# EAGLE design large-vfd-clock (EAGLE 7.5.0)
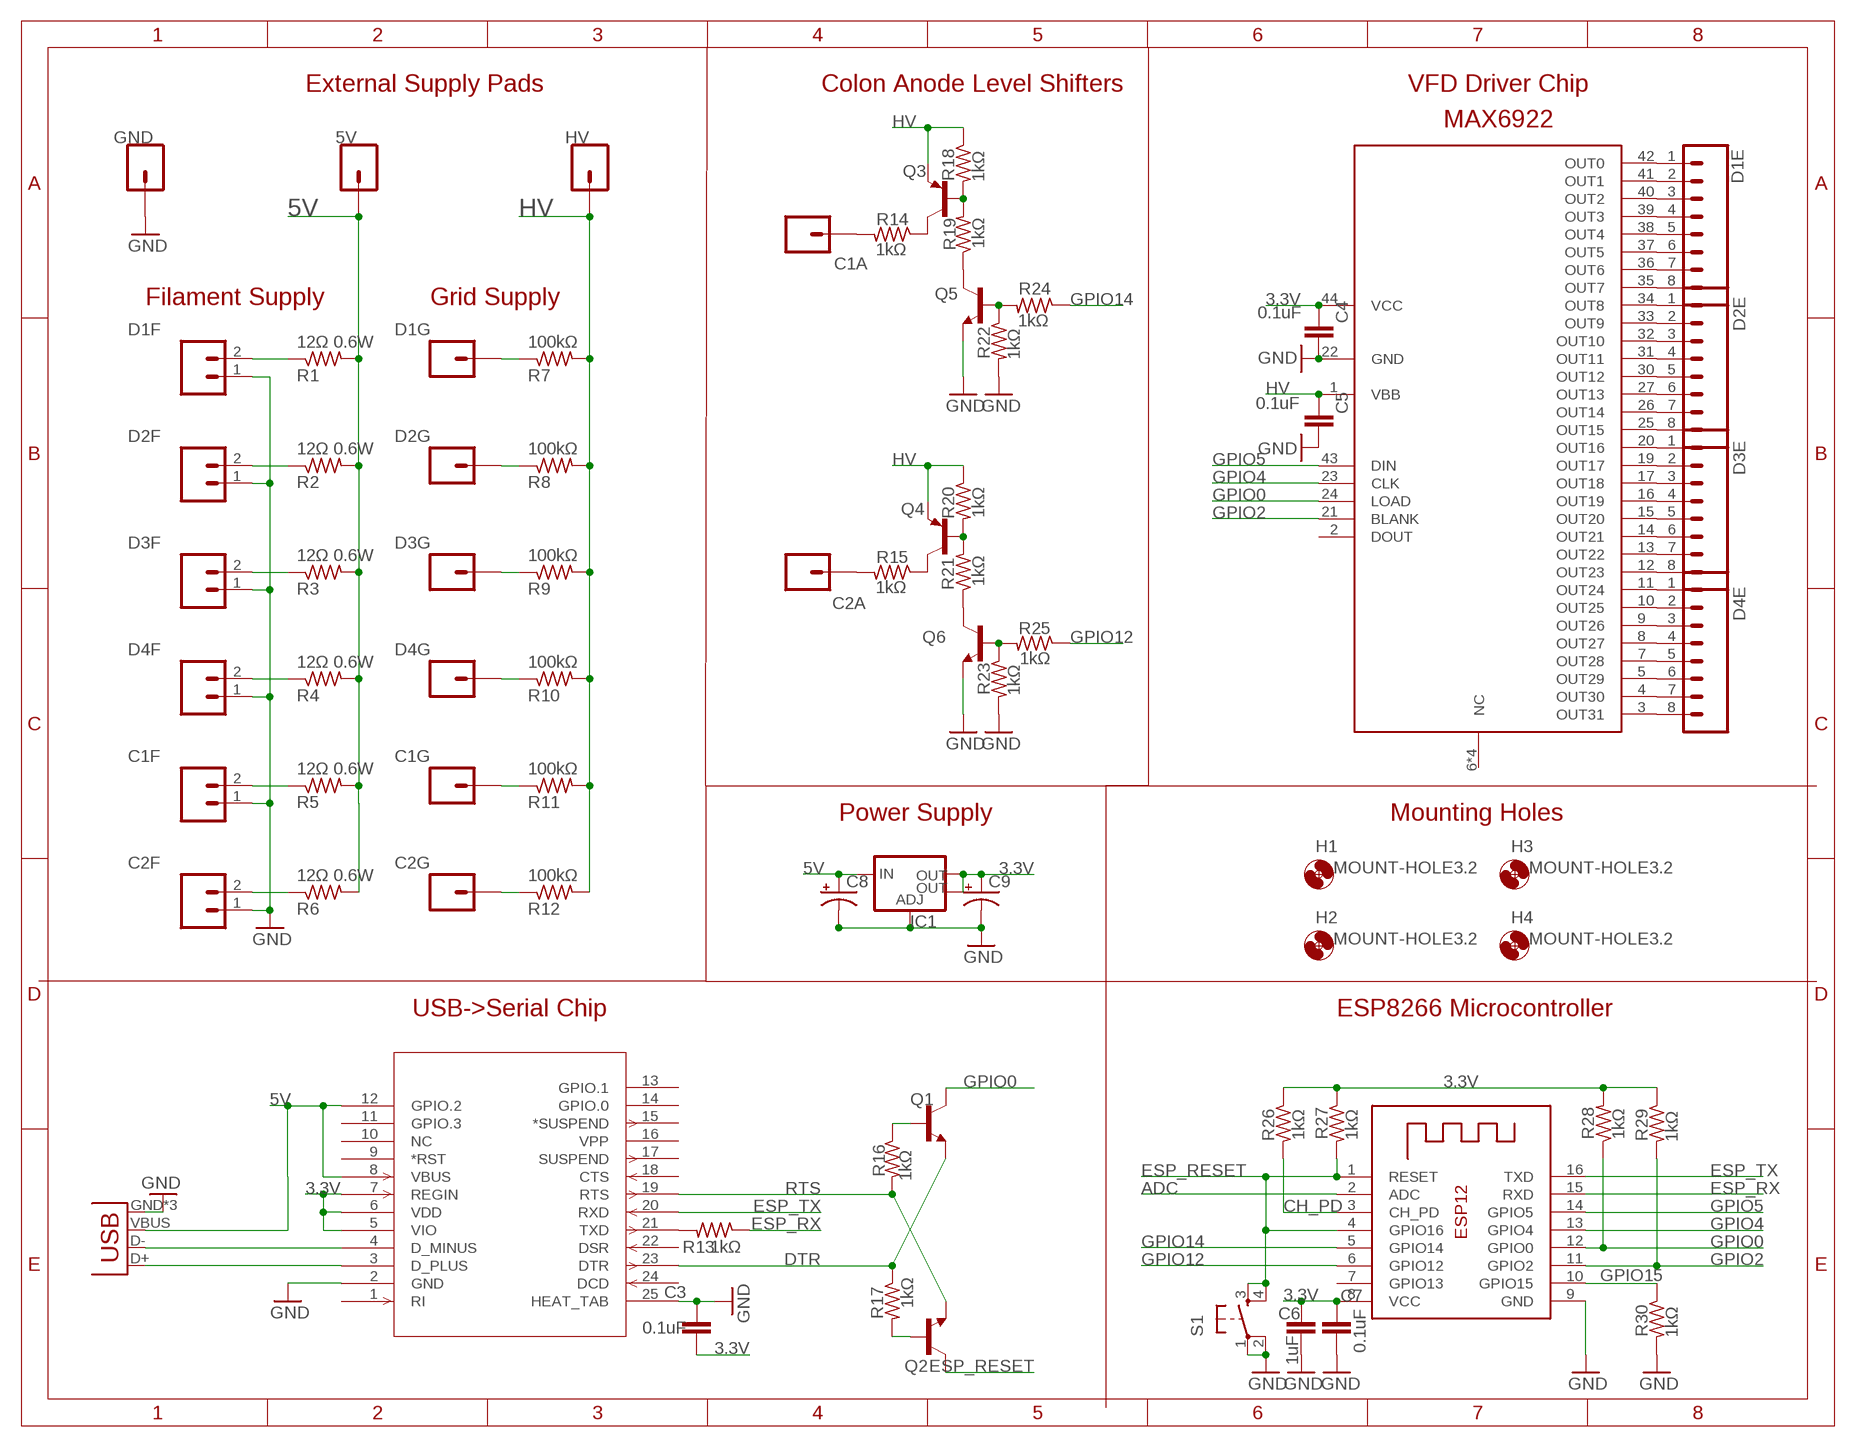
[diagram p0: schematic, sheet 1]

## Parts
5V  M01PTH_LONGPAD  [1X01_LONGPAD]
C1A  M01PTH_LONGPAD  [1X01_LONGPAD]
C1F  M02LOCK_LONGPADS  [1X02_LOCK_LONGPADS]
C1G  M01PTH_LONGPAD  [1X01_LONGPAD]
C2A  M01PTH_LONGPAD  [1X01_LONGPAD]
C2F  M02LOCK_LONGPADS  [1X02_LOCK_LONGPADS]
C2G  M01PTH_LONGPAD  [1X01_LONGPAD]
C3  0.1uF  C-EU025-024X044  [C025-024X044]
C4  0.1uF  C-EU025-024X044  [C025-024X044]
C5  0.1uF  C-EU025-024X044  [C025-024X044]
C6  1uF  C-EU025-024X044  [C025-024X044]
C7  0.1uF  C-EU025-024X044  [C025-024X044]
C8  CPOL-USE2,5-6E  [E2,5-6E]
C9  CPOL-USE2,5-6E  [E2,5-6E]
D1E  M08LOCK_LONGPADS  [1X08_LOCK_LONGPADS]
D1F  M02LOCK_LONGPADS  [1X02_LOCK_LONGPADS]
D1G  M01PTH_LONGPAD  [1X01_LONGPAD]
D2E  M08LOCK_LONGPADS  [1X08_LOCK_LONGPADS]
D2F  M02LOCK_LONGPADS  [1X02_LOCK_LONGPADS]
D2G  M01PTH_LONGPAD  [1X01_LONGPAD]
D3E  M08LOCK_LONGPADS  [1X08_LOCK_LONGPADS]
D3F  M02LOCK_LONGPADS  [1X02_LOCK_LONGPADS]
D3G  M01PTH_LONGPAD  [1X01_LONGPAD]
D4E  M08LOCK_LONGPADS  [1X08_LOCK_LONGPADS]
D4F  M02LOCK_LONGPADS  [1X02_LOCK_LONGPADS]
D4G  M01PTH_LONGPAD  [1X01_LONGPAD]
GND  M01PTH_LONGPAD  [1X01_LONGPAD]
H1  MOUNT-HOLE3.2  [3,2]
H2  MOUNT-HOLE3.2  [3,2]
H3  MOUNT-HOLE3.2  [3,2]
H4  MOUNT-HOLE3.2  [3,2]
HV  M01PTH_LONGPAD  [1X01_LONGPAD]
IC1  V_REG_LM1117SOT223  [SOT223]
JP8  SPARKFUN-CONNECTORS_USB-MICROB  [SPARKFUN-CONNECTORS_USB-MICROB]
Q1  MMBT2222A  TRANSISTOR_NPNTO92  [TO-92]
Q2  MMBT2222A  TRANSISTOR_NPNTO92  [TO-92]
Q3  MMBT3906  2N3906  [TO92]
Q4  MMBT3906  2N3906  [TO92]
Q5  MMBT2222A  TRANSISTOR_NPNTO92  [TO-92]
Q6  MMBT2222A  TRANSISTOR_NPNTO92  [TO-92]
R1  12Ω 0.6W  R-US_0207/7  [0207/7]
R2  12Ω 0.6W  R-US_0207/7  [0207/7]
R3  12Ω 0.6W  R-US_0207/7  [0207/7]
R4  12Ω 0.6W  R-US_0207/7  [0207/7]
R5  12Ω 0.6W  R-US_0207/7  [0207/7]
R6  12Ω 0.6W  R-US_0207/7  [0207/7]
R7  100kΩ  R-US_0207/7  [0207/7]
R8  100kΩ  R-US_0207/7  [0207/7]
R9  100kΩ  R-US_0207/7  [0207/7]
R10  100kΩ  R-US_0207/7  [0207/7]
R11  100kΩ  R-US_0207/7  [0207/7]
R12  100kΩ  R-US_0207/7  [0207/7]
R13  1kΩ  R-US_0207/7  [0207/7]
R14  1kΩ  R-US_0207/7  [0207/7]
R15  1kΩ  R-US_0207/7  [0207/7]
R16  1kΩ  R-US_0207/7  [0207/7]
R17  1kΩ  R-US_0207/7  [0207/7]
R18  1kΩ  R-US_0207/7  [0207/7]
R19  1kΩ  R-US_0207/7  [0207/7]
R20  1kΩ  R-US_0207/7  [0207/7]
R21  1kΩ  R-US_0207/7  [0207/7]
R22  1kΩ  R-US_0207/7  [0207/7]
R23  1kΩ  R-US_0207/7  [0207/7]
R24  1kΩ  R-US_0207/7  [0207/7]
R25  1kΩ  R-US_0207/7  [0207/7]
R26  1kΩ  R-US_0207/7  [0207/7]
R27  1kΩ  R-US_0207/7  [0207/7]
R28  1kΩ  R-US_0207/7  [0207/7]
R29  1kΩ  R-US_0207/7  [0207/7]
R30  1kΩ  R-US_0207/7  [0207/7]
S1  TAC_SWITCHPTH  [TACTILE-PTH]
U1  CP2104-GM  [QFN24_4X4]
U2  MAX6922  [PLCC44]
X1  ESP-12  [ESP-12]

## Nets
3.3V [power]: C3.2 C4.1 C6.1 C7.1 C9.+ IC1.2(OUT) IC1.4(OUT) R26.1 R27.1 R28.2 R29.1 U1.5(VIO) U1.6(VDD) U1.7(REGIN) U2.44(VCC) X1.8(VCC)
5V [power]: 5V.1 C8.+ IC1.3(IN) JP8.VBUS R1.2 R2.2 R3.2 R4.2 R5.2 R6.2 U1.8(VBUS) U1.12(GPIO.2)
ADC: X1.2(ADC)
CH_PD: R26.2 X1.3(CH_PD)
D_N1 [usb lines]: JP8.D- U1.4(D_MINUS)
D_P1 [usb lines]: JP8.D+ U1.3(D_PLUS)
DTR: Q1.1(E) R17.1 U1.23(DTR)
ESP_RESET: Q2.3(C) R27.2 S1.3 S1.4 X1.1(RESET) X1.4(GPIO16)
ESP_RX: R13.1 X1.15(RXD)
ESP_TX: U1.20(RXD) X1.16(TXD)
GND [power]: C1F.1 C2F.1 C3.1 C4.2 C5.2 C6.2 C7.2 C8.- C9.- D1F.1 D2F.1 D3F.1 D4F.1 GND.1 IC1.1(ADJ) JP8.GND JP8.MT1(GND) JP8.MT2(GND) Q5.1(E) Q6.1(E) R22.2 R23.2 R30.2 S1.1 S1.2 U1.2(GND) U1.25(HEAT_TAB) U2.22(GND) X1.9(GND)
GPIO0: Q1.3(C) R28.1 U2.24(LOAD) X1.12(GPIO0)
GPIO2: R29.2 U2.21(BLANK) X1.11(GPIO2)
GPIO4: U2.23(CLK) X1.13(GPIO4)
GPIO5: U2.43(DIN) X1.14(GPIO5)
GPIO12: R25.1 X1.6(GPIO12)
GPIO14: R24.1 X1.5(GPIO14)
GPIO15: R30.1 X1.10(GPIO15)
HV [power]: C5.1 HV.1 Q3.3(E) Q4.3(E) R7.2 R8.2 R9.2 R10.2 R11.2 R12.2 R18.1 R20.1 U2.1(VBB)
N$2: R13.2 U1.21(TXD)
N$5: D1E.1 U2.42(OUT0)
N$6: Q1.2(B) R16.1
N$7: Q2.2(B) R17.2
N$10: D1E.2 U2.41(OUT1)
N$12: D1E.3 U2.40(OUT2)
N$13: D1E.4 U2.39(OUT3)
N$14: D1E.5 U2.38(OUT4)
N$15: D1E.6 U2.37(OUT5)
N$16: D1E.7 U2.36(OUT6)
N$17: D1E.8 U2.35(OUT7)
N$18: D2E.1 U2.34(OUT8)
N$19: D2E.2 U2.33(OUT9)
N$20: D2E.3 U2.32(OUT10)
N$21: D2E.4 U2.31(OUT11)
N$22: D2E.5 U2.30(OUT12)
N$23: D2E.6 U2.27(OUT13)
N$24: D2E.7 U2.26(OUT14)
N$25: D2E.8 U2.25(OUT15)
N$26: D3E.1 U2.20(OUT16)
N$27: D3E.2 U2.19(OUT17)
N$28: D3E.3 U2.17(OUT18)
N$29: D3E.4 U2.16(OUT19)
N$30: D3E.5 U2.15(OUT20)
N$31: D3E.6 U2.14(OUT21)
N$32: D3E.7 U2.13(OUT22)
N$33: D3E.8 U2.12(OUT23)
N$34: D4E.1 U2.11(OUT24)
N$35: D4E.2 U2.10(OUT25)
N$36: D4E.3 U2.9(OUT26)
N$37: D4E.4 U2.8(OUT27)
N$38: D4E.5 U2.7(OUT28)
N$39: D4E.6 U2.5(OUT29)
N$40: D4E.7 U2.4(OUT30)
N$41: D4E.8 U2.3(OUT31)
N$42: Q5.2(B) R22.1 R24.2
N$43: Q6.2(B) R23.1 R25.2
N$44: D4G.1 R10.1
N$45: D3G.1 R9.1
N$46: D2G.1 R8.1
N$47: D1G.1 R7.1
N$48: C2G.1 R12.1
N$49: C1G.1 R11.1
N$50: C1F.2 R5.1
N$51: C2F.2 R6.1
N$52: Q4.1(C) R15.1
N$53: Q3.1(C) R14.1
N$54: C1A.1 R14.2
N$55: C2A.1 R15.2
N$58: D1F.2 R1.1
N$59: D2F.2 R2.1
N$60: D3F.2 R3.1
N$61: D4F.2 R4.1
N$63: Q5.3(C) R19.1
N$64: Q3.2(B) R18.2 R19.2
N$65: Q6.3(C) R21.1
N$66: Q4.2(B) R20.2 R21.2
RTS: Q2.1(E) R16.2 U1.19(RTS)
Unconnected: U1.1(RI) U1.9(*RST) U1.10(NC) U1.11(GPIO.3) U1.13(GPIO.1) U1.14(GPIO.0) U1.15(*SUSPEND) U1.16(VPP) U1.17(SUSPEND) U1.18(CTS) U1.22(DSR) U1.24(DCD) U2.2(DOUT) U2.6(NC) U2.18(NC) U2.28(NC) U2.29(NC) X1.7(GPIO13)

## Notes on the sheet
- External Supply Pads | Colon Anode Level Shifters | VFD Driver Chip
- MAX6922
- Filament Supply | Grid Supply
- Power Supply | Mounting Holes
- USB->Serial Chip | ESP8266 Microcontroller

## Library data of the parts
5V C1A C1G C2A C2G D1G D2G D3G D4G GND HV = SparkFun-Connectors:M01: Header 1 Standard 1-pin 0.1" header. Use with straight break away headers (SKU : PRT-00116), right angle break away headers (PRT-00553), swiss pins (PRT-00743), machine pins (PRT-00117), and female headers (PRT-00115). SMTSO-256-ET is a "flush mount" nut for a 4-40 screw. The older package used to be too tight, and did not allow it to sit properly thru the drill hit. The latest (0.165DIA) fits nice and snug.
C1F C2F D1F D2F D3F D4F = SparkFun-Connectors:M02: Standard 2-pin 0.1" header. Use with - straight break away headers ( PRT-00116) - right angle break away headers (PRT-00553) - swiss pins (PRT-00743) - machine pins (PRT-00117) - female headers (PRT-00115) Molex polarized connector foot print use with: PRT-08233 with associated crimp pins and housings. 2.54_SCREWTERM for use with PRT-10571. 3.5mm Screw Terminal footprints for PRT-08084 5mm Screw Terminal footprints for use with PRT-08432
C3-C7 = rcl:C-EU: CAPACITOR, European symbol
C8 C9 = rcl:CPOL-US: POLARIZED CAPACITOR, American symbol
D1E D2E D3E D4E = SparkFun-Connectors:M08: Header 8 Standard 8-pin 0.1" header. Use with straight break away headers (SKU : PRT-00116), right angle break away headers (PRT-00553), swiss pins (PRT-00743), machine pins (PRT-00117), and female headers (PRT-00115).
H1-H4 = holes:MOUNT-HOLE: MOUNTING HOLE with drill center marker
IC1 = SparkFun-PowerIC:V_REG_LM1117: Voltage Regulator LM1117 Standard adjustable voltage regulator but in SMD form. Spark Fun Electronics SKU : COM-00595; PROD_ID: VREG-08170
JP8 = passKeyDev2:SPARKFUN-CONNECTORS_USB: USB Connectors USB-B-PTH is fully proven SKU : PRT-00139/CONN-08278 USB-miniB is fully proven SKU : PRT-00587 USB-A-PCB is untested. USB-A-H is throughly reviewed, but untested. Spark Fun Electronics SKU : PRT-00437 USB-B-SMT is throughly reviewed, but untested. Needs silkscreen touching up. USB-A-S has not been used/tested USB-MB-H has not been used/tested USB-MICROB has been used. CONN-09505; PROD_ID: CONN-09505
Q1 Q2 Q5 Q6 = SparkFun-DiscreteSemi:TRANSISTOR_NPN: Generic NPN BJT MMBT2222A - TRANS-08049 (SOT-23, 1A 40V) MPSA42 - TRANS-09116 (SOT-23, 500mA 300V) MMBT5088LT1G - TRANS-11160 (SOT-23, 50 mA 30V) BC547 - COM-08928 <http://www.sparkfun.com/products/8928> (TO-92 45V 100mA) (1.Collector 2.Base 3.Emitter) 2N3904 - COM-00521 <http://www.sparkfun.com/products/521> (TO-92 40V 200mA) (1.Emitter 2.Base 3.Collector) P2N2222A - COM-12852 <http://www.sparkfun.com/products/12852> (TO-92 40V 600mA) (1.Collector 2.Base 3.Emitter)
Q3 Q4 = transistor-pnp:2N3906: PNP Transistor
R1-R30 = resistor:R-US_: RESISTOR, American symbol
S1 = SparkFun-Electromechanical:TAC_SWITCH: Momentary Switch Button commonly used for reset or general input. Spark Fun Electronics SKU : COM-00097 SMT- SWCH-08247
U1 = cp2104:CP2104-GM
U2 = sonik:MAX6922
X1 = adafruit:ESP-12

## Net classes
2 power: width 0.254 mm

## Board
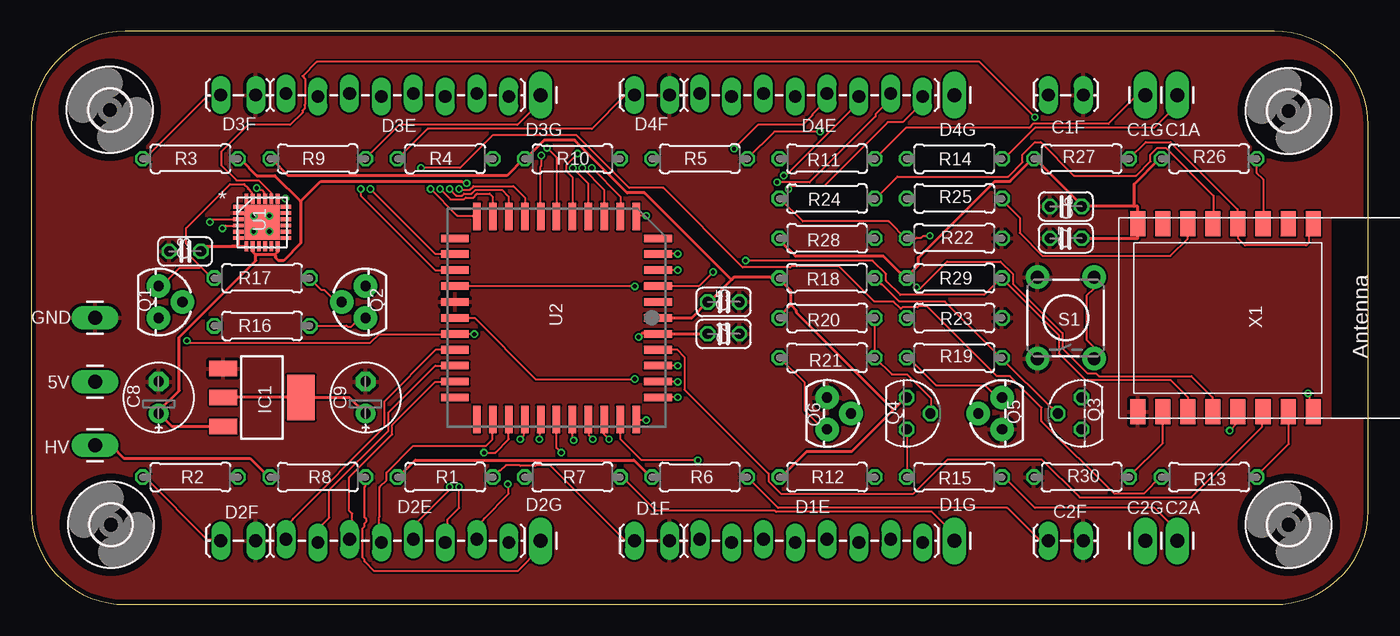
[diagram p1: board, top side]
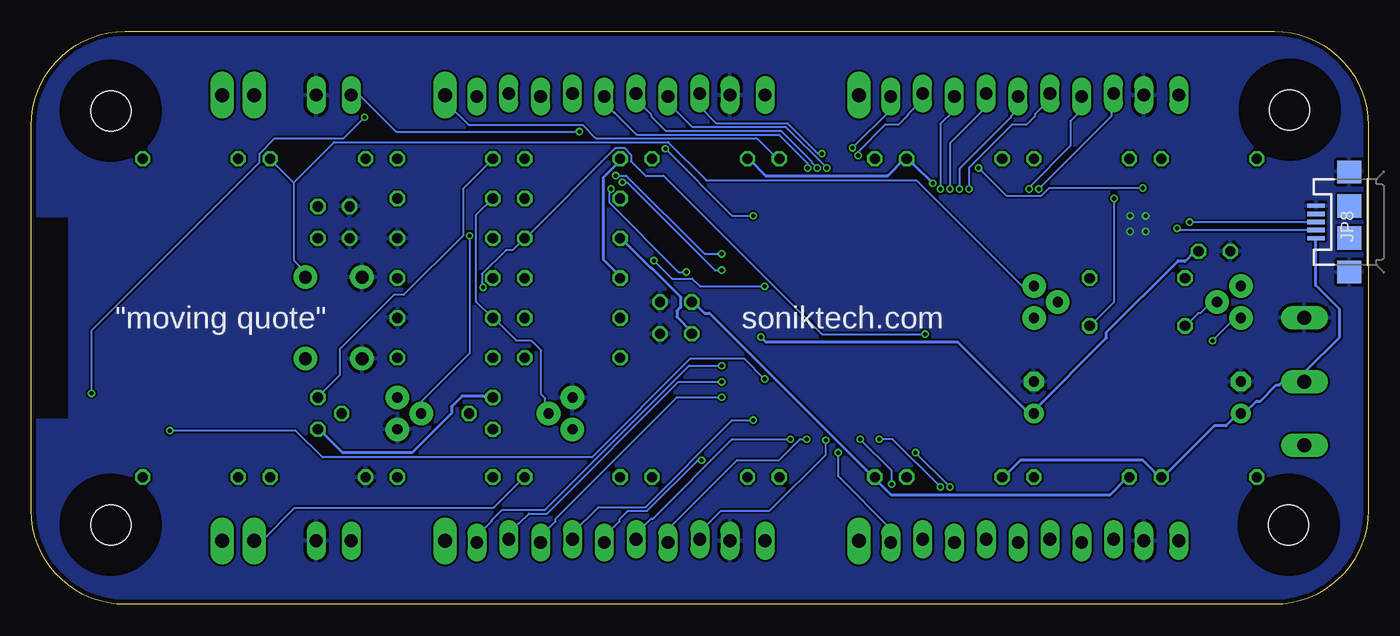
[diagram p2: board, bottom side, seen from below]

Size 106.68 x 45.72 mm. Coordinates in mm from the lower left corner, seen from the top.
Outline: 106.68,7.5 106.68,38.22 arc90 99.18,45.72 7.5,45.72 arc90 0,38.22 0,7.5 arc90 7.5,0 99.18,0 arc90 106.68,7.5
Copper layers (1*16): Top 0.0356mm / dielectric 1.5011mm / Bottom 0.0356mm
Design rules "OSHparkDruTented": minimum track width 6mil, minimum drill 13mil, track to track 6mil, track to pad 6mil, pad to pad 6mil, via to via 6mil, smd to smd 5mil, copper to edge 15mil, drill to drill 6mil, minimum pad ring 5mil, minimum via ring 5mil, stop-mask expansion 3mil, vias tented up to drill 14mil, thermal gap 10mil

### Footprints (pad centres in the part's own frame; a part is rotated, then mirrored left to right if it is on the bottom)
1X01_LONGPAD = drill 1.118 pad 1.88 long: 1 0,0
1X02_LOCK_LONGPADS = drill 1.016 long: 1 -0.127,0; 2 2.667,0
C025-024X044 = drill 0.813 octagon: 1 -1.27,0; 2 1.27,0
E2,5-6E = drill 0.813 pad 1.575: + -1.27,0 | drill 0.813 pad 1.575 octagon: - 1.27,0
1X08_LOCK_LONGPADS = drill 1.016 long: 1 0,0.127; 2 2.54,-0.127; 3 5.08,0.127; 4 7.62,-0.127; 5 10.16,0.127; 6 12.7,-0.127; 7 15.24,0.127; 8 17.78,-0.127
3,2 = hole 3.2: 0,0
SOT223 = smd 1.219 x 2.235: 1 -2.311,-3.099; 2 0,-3.099; 3 2.311,-3.099 | smd 3.6 x 2.2: 4 0,3.099
SPARKFUN-CONNECTORS_USB-MICROB = smd 0.35 x 1.4: D+ 0,2.65; D- -0.65,2.65; GND 1.3,2.65; ID 0.65,2.65; VBUS -1.3,2.65 | smd 1.8 x 1.9: MT1 -4,0; MT2 4,0 | smd 1.9 x 1.9: P$1 -1.27,0; P$2 1.27,0
TO-92 = drill 0.813 pad 1.88: 1 -1.27,0; 2 0,1.905; 3 1.27,0
TO92 = drill 0.813 octagon: 1 1.27,0; 2 0,1.905; 3 -1.27,0
0207/7 = drill 0.813 octagon: 1 -3.81,0; 2 3.81,0
TACTILE-PTH = drill 1.016 pad 1.88: 1 -3.251,2.261; 2 3.251,2.261; 3 -3.251,-2.261; 4 3.251,-2.261
QFN24_4X4 = smd 0.813 x 0.305: 1 -1.892,1.25; 2 -1.892,0.75; 3 -1.892,0.25; 4 -1.892,-0.25; 5 -1.892,-0.75; 6 -1.892,-1.25; 13 1.892,-1.25; 14 1.892,-0.75; 15 1.892,-0.25; 16 1.892,0.25; 17 1.892,0.75; 18 1.892,1.25 | smd 0.305 x 0.813: 7 -1.25,-1.892; 8 -0.75,-1.892; 9 -0.25,-1.892; 10 0.25,-1.892; 11 0.75,-1.892; 12 1.25,-1.892; 19 1.25,1.892; 20 0.75,1.892; 21 0.25,1.892; 22 -0.25,1.892; 23 -0.75,1.892; 24 -1.25,1.892 | smd 2.794 x 2.794: 25 0,0
PLCC44 = smd 0.6 x 2.2: 1 0,8.1; 2 -1.27,8.1; 3 -2.54,8.1; 4 -3.81,8.1; 5 -5.08,8.1; 6 -6.35,8.1; 18 -6.35,-8.1; 19 -5.08,-8.1; 20 -3.81,-8.1; 21 -2.54,-8.1; 22 -1.27,-8.1; 23 0,-8.1; 24 1.27,-8.1; 25 2.54,-8.1; 26 3.81,-8.1; 27 5.08,-8.1; 28 6.35,-8.1; 40 6.35,8.1; 41 5.08,8.1; 42 3.81,8.1; 43 2.54,8.1; 44 1.27,8.1 | smd 2.2 x 0.6: 7 -8.1,6.35; 8 -8.1,5.08; 9 -8.1,3.81; 10 -8.1,2.54; 11 -8.1,1.27; 12 -8.1,0; 13 -8.1,-1.27; 14 -8.1,-2.54; 15 -8.1,-3.81; 16 -8.1,-5.08; 17 -8.1,-6.35; 29 8.1,-6.35; 30 8.1,-5.08; 31 8.1,-3.81; 32 8.1,-2.54; 33 8.1,-1.27; 34 8.1,0; 35 8.1,1.27; 36 8.1,2.54; 37 8.1,3.81; 38 8.1,5.08; 39 8.1,6.35
ESP-12 = smd 2 x 1.2: 1 -7.5,4.5; 2 -7.5,2.5; 3 -7.5,0.5; 4 -7.5,-1.5; 5 -7.5,-3.5; 6 -7.5,-5.5; 7 -7.5,-7.5; 8 -7.5,-9.5; 9 7.5,-9.5; 10 7.5,-7.5; 11 7.5,-5.5; 12 7.5,-3.5; 13 7.5,-1.5; 14 7.5,0.5; 15 7.5,2.5; 16 7.5,4.5

### Placement (x,y rotation side)
5V  5.08,17.78 270 top
C1A  91.44,40.64 0 top
C1F  83.82,40.64 180 top
C1G  88.9,40.64 0 top
C2A  91.44,5.08 0 top
C2F  83.82,5.08 180 top
C2G  88.9,5.08 0 top
C3  12.27,28.17 0 top
C4  55.24,21.59 0 top
C5  55.24,24.13 0 top
C6  82.55,31.75 180 top
C7  82.55,29.21 180 top
C8  10.16,16.51 90 top
C9  26.67,16.51 90 top
D1E  71.12,5.08 180 top
D1F  50.8,5.08 180 top
D1G  73.66,5.08 0 top
D2E  38.1,5.08 180 top
D2F  17.78,5.08 180 top
D2G  40.64,5.08 0 top
D3E  20.32,40.64 0 top
D3F  17.78,40.64 180 top
D3G  40.64,40.64 180 top
D4E  53.34,40.64 0 top
D4F  50.8,40.64 180 top
D4G  73.66,40.64 180 top
GND  5.08,22.86 270 top
H1  6.27,39.45 270 top
H2  6.35,6.35 270 top
H3  100.33,39.37 270 top
H4  100.33,6.35 270 top
HV  5.08,12.7 270 top
IC1  18.41,16.51 270 top
JP8  1.5,30.51 90 bottom
Q1  10.16,24.13 270 top
Q2  26.67,24.13 90 top
Q3  83.82,15.24 90 top
Q4  69.85,15.24 270 top
Q5  77.47,15.24 90 top
Q6  63.5,15.24 270 top
R1  33.02,10.16 180 top
R2  12.7,10.16 0 top
R3  12.7,35.56 0 top
R4  33.02,35.56 0 top
R5  53.34,35.56 180 top
R6  53.34,10.16 180 top
R7  43.18,10.16 180 top
R8  22.86,10.16 180 top
R9  22.86,35.56 180 top
R10  43.18,35.56 180 top
R11  63.5,35.56 180 top
R12  63.5,10.16 180 top
R13  93.98,10.16 180 top
R14  73.66,35.56 0 top
R15  73.66,10.16 0 top
R16  18.41,22.23 0 top
R17  18.41,26.04 0 top
R18  63.5,26.04 0 top
R19  73.66,19.68 0 top
R20  63.5,22.86 0 top
R21  63.5,19.68 0 top
R22  73.66,29.21 0 top
R23  73.66,22.86 0 top
R24  63.5,32.38 180 top
R25  73.66,32.38 180 top
R26  93.98,35.56 0 top
R27  83.82,35.56 0 top
R28  63.5,29.21 180 top
R29  73.66,26.04 0 top
R30  83.82,10.16 180 top
S1  82.55,22.86 90 top
U1  18.41,30.48 0 top
U2  41.91,22.86 270 top
X1  97.79,22.86 270 top

### Tracks (layer width: path | path; a pad name or v marks a point on that pad's centre or on a via)
3.3V  (via drill 0.33)
  Top 0.254: 88.01,31.75 88.29,31.75 X1.8 88.29,29.21 C7.1 | 88.01,31.75 C6.1 83.82,31.85 80.16,35.51 80.01,35.51 R27.1 79.93,35.43 79.78,35.43 78.11,33.76 76.89,33.76 70.79,27.66 70.79,27.05 69.88,26.14 R29.1 69.8,26.06 69.42,26.44 69.34,26.44 67.97,27.81 60.96,27.81 59.74,29.03 59.74,29.18 R28.2 | C4.1 U2.44 49.91,21.64 48.77,21.64 v48.46,21.34 | C9.+ 25.4,16.51 IC1.4 21.41,16.54 15.32,16.54 IC1.2 | C3.2 13.54,28.59 16,28.59 | 16,28.59 U1.7 | U1.5 U1.6 16.52,28.59 16,28.59 | R26.1 90.14,35.51 89.99,35.51 88.01,33.53 88.01,31.85 88.01,31.75
  Bottom 0.254: C3.2 13.56,28.12 13.87,28.12 14.63,27.36 14.71,27.43 15.16,27.43 20.88,21.72 20.88,21.26 26.67,15.47 C9.+ 26.75,15.54 27.36,15.54 32.77,20.95 48.08,20.95 v48.46,21.34 | C4.1 54.03,21.64 54.03,21.79 55.17,22.94 55.17,23.39 54.86,23.7 54.86,24.54 57.15,26.82 57.23,26.82 59.66,29.26 R28.2
5V  (via drill 0.33)
  Top 0.254: IC1.3 11.2,14.2 C8.+ 10.06,15.32 11.81,17.07 11.81,21.34 17.91,27.43 17.91,27.81 17.91,27.89 | 17.91,27.89 17.68,28.12 17.68,28.57 U1.8 | 19.43,27.89 17.91,27.89 | 19.43,27.89 19.66,28.12 19.66,28.57 U1.12 | 21.49,32.16 21.49,28.8 20.12,27.43 19.74,27.43 19.51,27.66 19.51,27.81 19.43,27.89 | 21.49,32.16 19.43,34.21 17.98,34.21 16.69,35.51 16.54,35.51 R3.2 | R6.2 49.53,10.21 49.38,10.21 48.08,11.51 30.63,11.51 29.26,10.13 R1.2 | v34.75,33.6 34.52,33.6 34.37,33.76 23.09,33.76 21.57,32.23 21.49,32.16
  Bottom 0.254: JP8.VBUS 4.19,29.18 4.19,25.45 2.29,23.55 2.29,21.34 5.03,18.59 5.03,17.83 5V.1 5.18,17.75 6.86,17.75 7.09,17.53 7.32,17.53 8.61,16.23 8.91,16.23 9.83,15.32 10.06,15.32 C8.+ 10.21,15.24 10.36,15.24 11.35,14.25 12.27,14.25 16.31,10.21 16.46,10.21 R2.2 16.61,10.13 17.98,11.51 27.74,11.51 29.03,10.21 29.18,10.21 R1.2 | R5.2 49.53,35.51 49.38,35.51 48.08,34.21 38.33,34.21 37.03,35.51 36.88,35.51 R4.2 36.73,35.51 36.35,35.13 36.27,35.13 v34.75,33.6
CH_PD
  Top 0.152: X1.3 98.3,30.4 98.3,33.91 97.77,34.44 97.77,35.51 R26.2
D_N1  (via drill 0.33)
  Top 0.152: v15.25,30 15.48,30.23 U1.4
  Bottom 0.152: JP8.D- 15.25,29.86 v15.25,30
D_P1  (via drill 0.33)
  Top 0.152: v14.25,30.5 14.48,30.73 U1.3
  Bottom 0.152: JP8.D+ v14.25,30.51 v14.25,30.5
DTR
  Top 0.152: 13.53,26.94 14.4,26.06 14.55,26.06 R17.1 | 13.53,26.94 12.65,27.81 12.65,28.5 12.34,28.8 12.34,30.02 15.85,33.53 16.99,33.53 17.3,33.22 17.3,33.15 17.6,32.84 17.6,32.38 U1.23 | Q1.1 10.21,25.45 10.44,25.45 11.81,26.82 13.41,26.82 13.49,26.9 13.53,26.94
ESP_RESET
  Top 0.152: X1.1 102.26,30.33 101.96,30.02 101.96,28.88 101.73,28.65 96.85,28.65 96.32,29.18 96.32,30.33 X1.4 96.24,30.4 96.24,31.55 90.91,36.88 88.92,36.88 87.63,35.59 R27.2 | S1.3 84.81,19.66 84.81,20.5 84.2,21.11 84.2,24.61 84.81,25.22 84.81,26.06 S1.4
  Bottom 0.152: 85.76,33.64 85.72,33.6 85.72,27.43 84.81,26.52 84.81,26.14 S1.4 | 85.76,33.64 87.63,35.51 R27.2 | Q2.3 26.67,25.38 27.58,25.38 36.04,33.83 52.81,33.83 55.85,36.88 82.53,36.88 85.72,33.68 85.76,33.64
ESP_RX
  Top 0.152: X1.15 100.36,15.32 100.36,12.8 97.77,10.21 R13.1
ESP_TX  (via drill 0.33)
  Top 0.152: v80.09,38.86 75.67,43.28 22.78,43.28 21.64,42.14 21.87,41.91 21.87,39.93 21.79,39.85 21.79,39.55 21.64,39.4 21.64,39.24 20.65,38.25 17.3,38.25 15.16,36.12 15.16,35.05 16.38,33.83 18.14,33.83 19.13,32.84 19.13,32.38 U1.20 | v101.88,16.84 102.03,16.69 102.03,15.62 102.26,15.39 X1.16
  Bottom 0.152: v80.09,38.86 81.76,37.19 87.25,37.19 88.47,35.97 88.47,35.28 101.88,21.87 v101.88,16.84
GND  (via drill 0.33)
  Top 0.254: U1.2 16.61,31.17 17.07,31.17 17.75,30.48 18.36,30.48 U1.25 17.75,30.48 v17.75,31
  other vias: 17.75,29.75 19,29.75 19,31
  pour Bottom: 0,45.72 0,0 106.68,0 106.68,45.72
  pour Top: 0,45.72 0,0 106.68,0 106.68,45.72
GPIO0  (via drill 0.33)
  Top 0.152: v12.42,21.03 12.57,20.88 27.05,20.88 27.74,21.57 33.76,21.57 U2.24 33.83,21.57 v35.36,21.57 | v70.64,25.3 70.71,25.22 70.94,25.22 73.08,27.36 77.34,27.36 78.33,26.36 78.33,25.6 82.3,21.64 82.3,20.42 84.28,18.44 84.96,18.44 85.19,18.21 92.58,18.21 94.26,16.54 94.26,15.39 X1.12
  Bottom 0.152: v12.42,21.03 10.59,22.86 10.21,22.86 Q1.3 | v70.64,25.3 70.64,25.6 70.71,25.68 70.71,26.36 68.81,28.27 68.28,28.27 67.36,29.18 R28.1 67.28,29.18 60.05,36.42 59.36,36.42 58.83,35.89 58.83,35.36 57.68,34.21 56.24,34.21 43.59,21.57 v35.36,21.57
GPIO2  (via drill 0.33)
  Top 0.152: X1.11 92.28,15.39 92.28,16.54 90.91,17.91 84.12,17.91 81.99,20.04 81.99,21.49 77.5,25.98 R29.2 77.42,26.06 76.05,24.69 69.34,24.69 68.2,25.83 68.2,26.36 67.13,27.43 v57,27.43 | v48.16,25.38 33.83,25.38 U2.21
  Bottom 0.152: v48.16,25.38 53.34,25.38 53.95,25.98 55.55,25.98 v57,27.43
GPIO4  (via drill 0.33)
  Top 0.152: v95.63,13.87 96.24,14.48 96.24,15.32 X1.13 | v48.16,17.98 40.23,17.98 35.36,22.86 33.83,22.86 U2.23
  Bottom 0.152: v95.63,13.87 85.57,13.87 83.44,11.73 61.95,11.73 54.1,19.58 49.76,19.58 v48.16,17.98
GPIO5
  Top 0.152: X1.14 98.22,15.32 98.22,14.17 92.58,8.53 83.67,8.53 80.62,11.58 73.15,11.58 70.41,8.84 59.82,8.84 58.83,9.83 58.83,10.44 52.12,17.14 52.12,19.74 51.51,20.34 50.06,20.34 U2.43
GPIO12
  Top 0.152: X1.6 92.28,30.33 92.28,29.18 90.91,27.81 80.7,27.81 78.87,29.64 78.87,30.86 77.5,32.23 77.5,32.38 R25.1
GPIO14
  Top 0.152: X1.5 94.34,30.4 94.34,32.61 90.53,36.42 89.84,36.42 89.31,35.89 89.31,35.36 88.16,34.21 83.21,34.21 80.54,36.88 80.09,36.88 79.1,35.89 79.1,35.28 77.95,34.14 69.11,34.14 67.36,32.38 R24.1
GPIO15
  Top 0.152: X1.10 90.3,15.32 90.3,12.88 87.63,10.21 R30.1
HV
  Top 0.254: U2.1 52.7,22.86 C5.1 54.03,24.08 55.85,25.91 | 68.81,15.54 69.8,16.54 Q4.3 | 68.81,15.54 65.46,12.19 61.87,12.19 59.89,10.21 59.74,10.21 R12.2 | R9.2 19.05,35.51 19.2,35.51 20.5,34.21 37.95,34.21 39.32,35.59 R10.2 39.47,35.59 40.92,37.03 43.36,37.03 47.55,32.84 48.92,32.84 55.78,25.98 55.85,25.91 | R8.2 19.05,10.21 18.9,10.21 17.45,11.66 7.39,11.66 6.4,12.65 5.11,12.65 HV.1 | 60.58,23.85 59.74,23.01 59.74,22.86 R20.1 | 60.58,23.85 60.58,25.07 59.66,25.98 R18.1 59.59,26.06 59.05,26.06 58.98,26.14 56.08,26.14 55.85,25.91 | 68.81,15.54 68.73,15.62 61.04,23.32 61.04,23.47 60.66,23.85 60.58,23.85
  Bottom 0.254: Q3.3 83.82,13.95 83.67,13.95 81.84,12.12 76.28,12.12 73.15,15.24 73.15,15.77 72.31,16.61 70.56,16.61 70.48,16.54 69.88,16.54 Q4.3 | R11.2 59.74,35.51 59.74,35.36 61.04,34.06 61.04,27.51 59.74,26.21 59.74,26.06 R18.1 | C5.1 53.95,24.08 53.8,24.08 52.96,23.24 52.58,23.24 39.55,10.21 39.4,10.21 R7.2 39.4,10.06 38.1,8.76 20.57,8.76 19.2,10.13 19.05,10.13 R8.2
N$2  (via drill 0.33)
  Top 0.152: v17.98,33.22 18.14,33.07 18.36,33.07 18.59,32.84 18.59,32.38 U1.21 | v31.09,34.82 34.21,34.82 36.8,37.41 43.51,37.41 47.7,33.22 50.44,33.22 56.77,26.9 60.58,26.9 60.66,26.98 64.47,26.98 67.28,24.16 68.81,24.16 69.34,23.62 69.42,23.62 69.49,23.7 70.71,23.7 70.79,23.77 71.48,23.77 77.04,18.21 78.11,18.21 80.62,15.7 80.62,14.63 86.41,8.84 88.77,8.84 90.14,10.21 R13.2
  Bottom 0.152: v17.98,33.22 25.45,33.22 26.06,32.61 28.88,32.61 v31.09,34.82
N$5  (via drill 0.33)
  Top 0.152: v51.59,19.05 50.06,19.05 U2.42
  Bottom 0.152: v51.59,19.05 54.18,19.05 65.68,7.54 69.11,7.54 69.95,6.71 69.95,6.63 71.09,5.49 71.09,4.95 D1E.1
N$6
  Bottom 0.152: R16.1 14.55,22.25 13.56,23.24 13.41,23.24 12.57,24.08 12.12,24.08 Q1.2
N$7
  Top 0.152: R17.2 22.25,25.98 23.16,25.07 23.39,25.07 24.31,24.16 24.77,24.16 Q2.2
N$10  (via drill 0.33)
  Top 0.152: v51.59,17.75 50.06,17.75 U2.41
  Bottom 0.152: v51.59,17.75 55.02,17.75 65.53,7.24 66.98,7.24 67.74,6.48 67.82,6.48 68.58,5.71 68.58,5.26 D1E.2
N$12  (via drill 0.33)
  Top 0.152: v51.59,16.54 50.06,16.54 U2.40
  Bottom 0.152: v51.59,16.54 55.17,16.54 64.85,6.86 64.85,6.63 65.99,5.49 65.99,4.95 D1E.3
N$13  (via drill 0.33)
  Top 0.152: v49.07,14.71 48.31,14.71 U2.39
  Bottom 0.152: v49.07,14.71 50.75,14.71 57.68,7.77 61.42,7.77 63.48,5.71 63.48,5.26 D1E.4
N$14  (via drill 0.33)
  Top 0.152: v53.19,11.51 48.69,11.51 47.02,13.18 47.02,14.71 U2.38
  Bottom 0.152: v53.19,11.51 53.49,11.51 57.53,7.47 59.05,7.47 59.74,6.78 59.74,6.63 60.96,5.41 D1E.5
N$15  (via drill 0.33)
  Top 0.152: v46.1,13.18 45.72,13.56 45.72,14.71 U2.37
  Bottom 0.152: v46.1,13.18 50.75,13.18 57.07,6.86 57.23,6.86 58.37,5.71 58.37,5.26 D1E.6
N$16  (via drill 0.33)
  Top 0.152: v44.81,13.18 44.5,13.49 44.5,14.71 U2.36
  Bottom 0.152: v44.81,13.18 45.34,13.18 47.02,11.51 50.37,11.51 55.85,6.02 55.85,4.95 D1E.7
N$17  (via drill 0.33)
  Top 0.152: v43.28,13.11 43.2,13.18 43.2,14.71 U2.35
  Bottom 0.152: v43.28,13.11 43.28,11.96 47.78,7.47 51.66,7.47 53.34,5.79 53.34,5.26 D1E.8
N$18  (via drill 0.33)
  Top 0.152: v42.29,12.12 41.91,12.5 41.91,14.71 U2.34
  Bottom 0.152: v42.29,12.12 42.29,10.21 38.1,6.02 D2E.1
N$19  (via drill 0.33)
  Top 0.152: v40.54,13.18 40.62,13.26 40.62,14.71 U2.33 | v38.02,9.6 38.1,9.53 38.1,8.84 36.12,6.86 36.12,6.78 35.59,6.25 35.59,5.26 D2E.2
  Bottom 0.152: v40.54,13.18 38.02,10.67 v38.02,9.6
N$20  (via drill 0.33)
  Top 0.152: v39.01,13.18 39.32,13.49 39.32,14.71 U2.32 | v34.14,9.37 34.14,7.7 33.22,6.78 33.22,6.48 33.07,6.33 33.07,4.95 D2E.3
  Bottom 0.152: v39.01,13.18 37.95,13.18 v34.14,9.37
N$21  (via drill 0.33)
  Top 0.152: v36.12,12.12 37.03,12.12 38.1,13.18 38.1,14.71 U2.31 | v33.38,9.37 33.38,9.14 30.48,6.25 30.48,5.26 D2E.4
  Bottom 0.152: v33.38,9.37 v36.12,12.12
N$22
  Top 0.152: U2.30 36.8,14.71 36.8,13.18 36.27,12.65 30.48,12.65 28.35,10.52 28.35,9.91 27.81,9.37 27.81,7.01 27.74,6.93 27.74,6.48 27.89,6.33 27.89,4.95 D2E.5
N$23
  Top 0.152: U2.27 33.76,17.75 32.23,17.75 28.8,14.33 28.8,13.56 25.38,10.13 25.38,7.47 25.6,7.24 25.6,6.71 25.45,6.55 25.45,5.26 D2E.6
N$24
  Top 0.152: D2E.7 22.86,6.02 23.77,6.93 23.77,9.14 28.5,13.87 28.5,15.32 32.23,19.05 33.76,19.05 U2.26
N$25
  Top 0.152: U2.25 33.76,20.34 32.31,20.34 28.19,16.23 28.19,14.17 20.88,6.86 20.88,6.78 20.34,6.25 20.34,5.26 D2E.8
N$26  (via drill 0.33)
  Top 0.152: v26.29,33.15 26.29,32.61 32.23,26.67 33.76,26.67 U2.20
  Bottom 0.152: v26.29,33.15 20.5,38.94 20.5,39.24 20.34,39.4 20.34,40.77 D3E.1
N$27  (via drill 0.33)
  Top 0.152: v27.05,33.15 32.23,27.96 33.76,27.96 U2.19
  Bottom 0.152: v27.05,33.15 27.05,33.3 23.77,36.58 23.77,38.56 22.86,39.47 22.86,40.46 D3E.2
N$28  (via drill 0.33)
  Top 0.152: v31.85,33.15 33.98,31.01 35.51,31.01 U2.17
  Bottom 0.152: v31.85,33.15 31.85,34.82 28.42,38.25 27.28,38.25 26.59,38.94 26.59,39.09 25.45,40.23 25.45,40.77 D3E.3
N$29  (via drill 0.33)
  Top 0.152: v32.61,33.15 33.45,32.31 34.52,32.31 34.67,32.46 35.28,32.46 35.59,32.77 36.58,32.77 36.8,32.54 36.8,31.01 U2.16
  Bottom 0.152: v32.61,33.15 32.61,34.75 28.5,38.86 28.5,38.94 27.96,39.47 27.96,40.46 D3E.4
N$30  (via drill 0.33)
  Top 0.152: v33.38,33.15 33.91,32.61 34.37,32.61 34.52,32.77 35.13,32.77 35.43,33.07 37.57,33.07 38.1,32.54 38.1,31.01 U2.15
  Bottom 0.152: v33.38,33.15 33.38,36.8 30.48,39.7 D3E.5
N$31  (via drill 0.33)
  Top 0.152: v34.14,33.15 34.21,33.07 34.98,33.07 35.28,33.38 38.48,33.38 39.4,32.46 39.4,31.01 U2.14
  Bottom 0.152: v34.14,33.15 34.14,38.33 33.07,39.4 33.07,40.46 D3E.6
N$32  (via drill 0.33)
  Top 0.152: v40.69,35.81 40.69,34.98 40.62,34.9 40.62,31.01 U2.13
  Bottom 0.152: v40.69,35.81 40.69,36.12 38.56,38.25 37.49,38.25 36.73,39.01 36.73,39.09 35.59,40.23 35.59,40.77 D3E.7
N$33  (via drill 0.33)
  Top 0.152: v41.15,36.42 41.91,35.66 41.91,31.01 U2.12
  Bottom 0.152: v41.15,36.42 38.1,39.47 38.1,40.46 D3E.8
N$34  (via drill 0.33)
  Top 0.152: v43.59,35.97 42.67,35.05 42.67,34.59 43.2,34.06 43.2,31.01 U2.11
  Bottom 0.152: v43.59,35.97 43.89,35.97 46.33,38.41 52.05,38.41 53.34,39.7 D4E.1
N$35  (via drill 0.33)
  Top 0.152: v43.2,34.82 44.42,33.6 44.42,31.01 U2.10
  Bottom 0.152: v43.2,34.82 46.48,38.1 53.95,38.1 55.85,40.01 55.85,40.46 D4E.2
N$36  (via drill 0.33)
  Top 0.152: v43.97,34.82 45.72,33.07 45.72,31.01 U2.9
  Bottom 0.152: v43.97,34.82 44.42,35.28 44.42,35.36 46.86,37.8 56.08,37.8 57.23,38.94 57.23,39.09 58.37,40.23 58.37,40.77 D4E.3
N$37  (via drill 0.33)
  Top 0.152: v44.73,34.82 47.02,32.54 47.02,31.01 U2.8
  Bottom 0.152: v44.73,34.82 44.73,35.2 47.02,37.49 58.37,37.49 60.12,39.24 60.2,39.24 60.96,40.01 60.96,40.46 D4E.4
N$38  (via drill 0.33)
  Top 0.152: v49.07,31.01 48.31,31.01 U2.7 | v56.08,36.35 57.99,38.25 61.57,38.25 62.33,39.01 62.33,39.09 63.48,40.23 63.48,40.77 D4E.5
  Bottom 0.152: v49.07,31.01 50.75,31.01 v56.08,36.35
N$39  (via drill 0.33)
  Top 0.152: v51.59,27.96 50.06,27.96 U2.5 | v60.05,34.21 60.2,34.21 65.99,40.01 65.99,40.46 D4E.6
  Bottom 0.152: v51.59,27.96 52.96,27.96 59.21,34.21 v60.05,34.21
N$40  (via drill 0.33)
  Top 0.152: v51.59,26.67 50.06,26.67 U2.4 | v59.51,33.68 62.1,33.68 67.36,38.94 67.36,39.09 68.58,40.31 D4E.7
  Bottom 0.152: v51.59,26.67 52.12,26.67 59.13,33.68 v59.51,33.68
N$41  (via drill 0.33)
  Top 0.152: v54.41,26.52 53.26,25.38 50.06,25.38 U2.3 | v60.43,33.15 60.66,33.38 63.25,33.38 68.35,38.48 69.57,38.48 71.09,40.01 71.09,40.46 D4E.8
  Bottom 0.152: v54.41,26.52 55.02,26.52 60.58,32.08 60.58,32.77 60.43,32.92 v60.43,33.15
N$42  (via drill 0.33)
  Top 0.152: R22.1 69.88,29.26 R22.1 | R24.2 59.74,32.38 61.57,30.56 68.43,30.56 69.8,29.18 R22.1 | v71.7,29.41 71.17,29.41 71.02,29.26 70.64,29.26 70.56,29.18 69.88,29.18 R22.1
  Bottom 0.152: v71.7,29.41 71.7,20.04 75.59,16.15 75.59,15.24 Q5.2
N$43
  Top 0.152: 69.88,22.86 R23.1 69.88,22.86
  Bottom 0.152: Q6.2 65.46,15.24 65.46,15.93 65.68,16.15 65.68,16.46 65.99,16.76 65.99,20.27 66.75,21.03 67.97,21.03 69.8,22.86 R23.1 69.88,22.86 71.17,24.16 71.17,31.09 69.88,32.38 R25.2
N$44
  Bottom 0.152: R10.1 47.02,35.59 47.17,35.59 48.77,37.19 61.65,37.19 62.71,38.25 71.78,38.25 73.61,40.08 73.61,40.62 D4G.1
N$45
  Top 0.152: R9.1 26.67,35.59 29.34,38.25 38.79,38.25 40.62,40.08 40.62,40.62 D3G.1
N$46
  Top 0.152: R8.1 26.67,10.13 26.67,9.45 26.59,9.37 26.59,6.93 26.75,6.78 26.75,6.63 26.59,6.48 26.59,6.25 26.44,6.1 26.44,3.73 26.59,3.58 26.59,3.43 27.36,2.67 38.79,2.67 40.62,4.5 40.62,5.03 D2G.1
N$47
  Top 0.152: R7.1 47.02,10.13 47.17,10.13 49.84,7.47 59.36,7.47 59.44,7.39 71.86,7.39 73.61,5.64 73.61,5.11 D1G.1
N$48
  Bottom 0.152: R12.1 67.36,10.13 69.8,7.7 85.65,7.7 88.24,5.11 88.85,5.11 C2G.1
N$49
  Top 0.152: R11.1 67.36,35.59 69.8,38.02 79.63,38.02 79.93,38.33 85.95,38.33 88.24,40.62 88.85,40.62 C1G.1
N$50  (via drill 0.33)
  Top 0.152: v62.94,37.72 59.28,37.72 57.15,35.59 R5.1
  Bottom 0.152: v62.94,37.72 77.57,37.72 80.47,40.62 81.15,40.62 C1F.2
N$51
  Top 0.152: R6.1 57.15,10.13 59.59,7.7 77.88,7.7 80.47,5.11 81.15,5.11 C2F.2
N$52
  Top 0.152: R15.1 69.88,10.21 69.88,13.95 Q4.1
N$53
  Bottom 0.152: Q3.1 83.82,16.54 82.07,18.29 82.07,20.34 77.72,24.69 76.96,24.69 72.24,29.41 72.24,33.15 69.88,35.51 R14.1
N$54
  Top 0.152: R14.2 77.5,35.59 77.65,35.59 80.09,38.02 89.61,38.02 91.44,39.85 91.44,40.62 C1A.1
N$55
  Top 0.152: R15.2 77.5,10.13 77.65,10.13 80.09,7.7 89.61,7.7 91.44,5.87 91.44,5.11 C2A.1
N$58
  Top 0.152: R1.1 36.88,10.21 37.34,10.67 37.41,10.67 37.87,11.12 38.94,11.12 39.01,11.05 40.23,11.05 40.31,11.12 41.38,11.12 47.4,5.11 48.08,5.11 D1F.2
N$59
  Top 0.152: R2.1 8.91,10.13 9.07,10.13 14.02,5.18 15.01,5.18 15.09,5.11 D2F.2
N$60
  Top 0.152: R3.1 8.91,35.59 9.07,35.59 14.02,40.54 15.01,40.54 15.09,40.62 D3F.2
N$61
  Top 0.152: R4.1 29.26,35.59 31.62,37.95 44.73,37.95 47.4,40.62 48.08,40.62 D4F.2
N$63
  Top 0.152: R19.1 69.88,19.66 70.03,19.66 72.24,17.45 76.12,17.45 77.04,16.54 77.42,16.54 Q5.3
N$64
  Top 0.152: 77.42,19.66 72.92,24.16 69.27,24.16 67.89,25.53 67.82,25.53 67.36,25.98 R18.2 | 77.42,19.66 R19.2 77.42,19.66 | Q3.2 81.46,15.7 81.38,15.7 77.42,19.66
N$65
  Top 0.152: R21.1 59.74,19.66 61.72,17.68 61.72,15.47 63.17,14.02 63.48,14.02 Q6.3
N$66
  Top 0.152: R20.2 67.28,22.86 67.28,19.74 R21.2 67.36,19.66 68.66,18.36 69.88,18.36 71.78,16.46 71.78,15.24 Q4.2 | R20.2 67.36,22.86 R20.2
RTS  (via drill 0.33)
  Top 0.152: v20.27,32.38 19.74,32.38 U1.19 | Q2.1 26.21,22.86 25.53,22.17 25.22,22.17 25.15,22.25 22.25,22.25 R16.2
  Bottom 0.152: v20.27,32.38 20.27,24.16 22.17,22.25 R16.2

### Text on the board
bNames: soniktech.com | "moving quote"